# Altium project 100835_project.prjpcb (part 2 of 2)

## Sheet Radio.SchDoc: Radio
size 431 x 279 mm; DrawnBy: D. Bruey, M.Ciuffo; Organization: Synapse Product Development, LLC.; Address1: 1511 6th Ave., Suite 400; Address2: Seattle, Washington 98101; Address3: 206.381.0898; Address4: www.synapse.com; DocumentNumber: 8; SheetNumber: 7; SheetTotal: 10; PageSetup: Record=PageOptions|CenterHorizontal=True|CenterVertical=True|PrintScale=0.95|XCorrection=1.00|YCorrection=1.00|PrintKind=1|BorderSize=5000000|LeftOffset=0|BottomOffset=0|Orientation=2|PaperLength=4318|PaperWidth=2794|Scale=100|PaperSource=7|PrintQuality=200|MediaType=1|DitherType=10|PrintScaleMode=1|PaperKind=11x17|PaperIndex=3
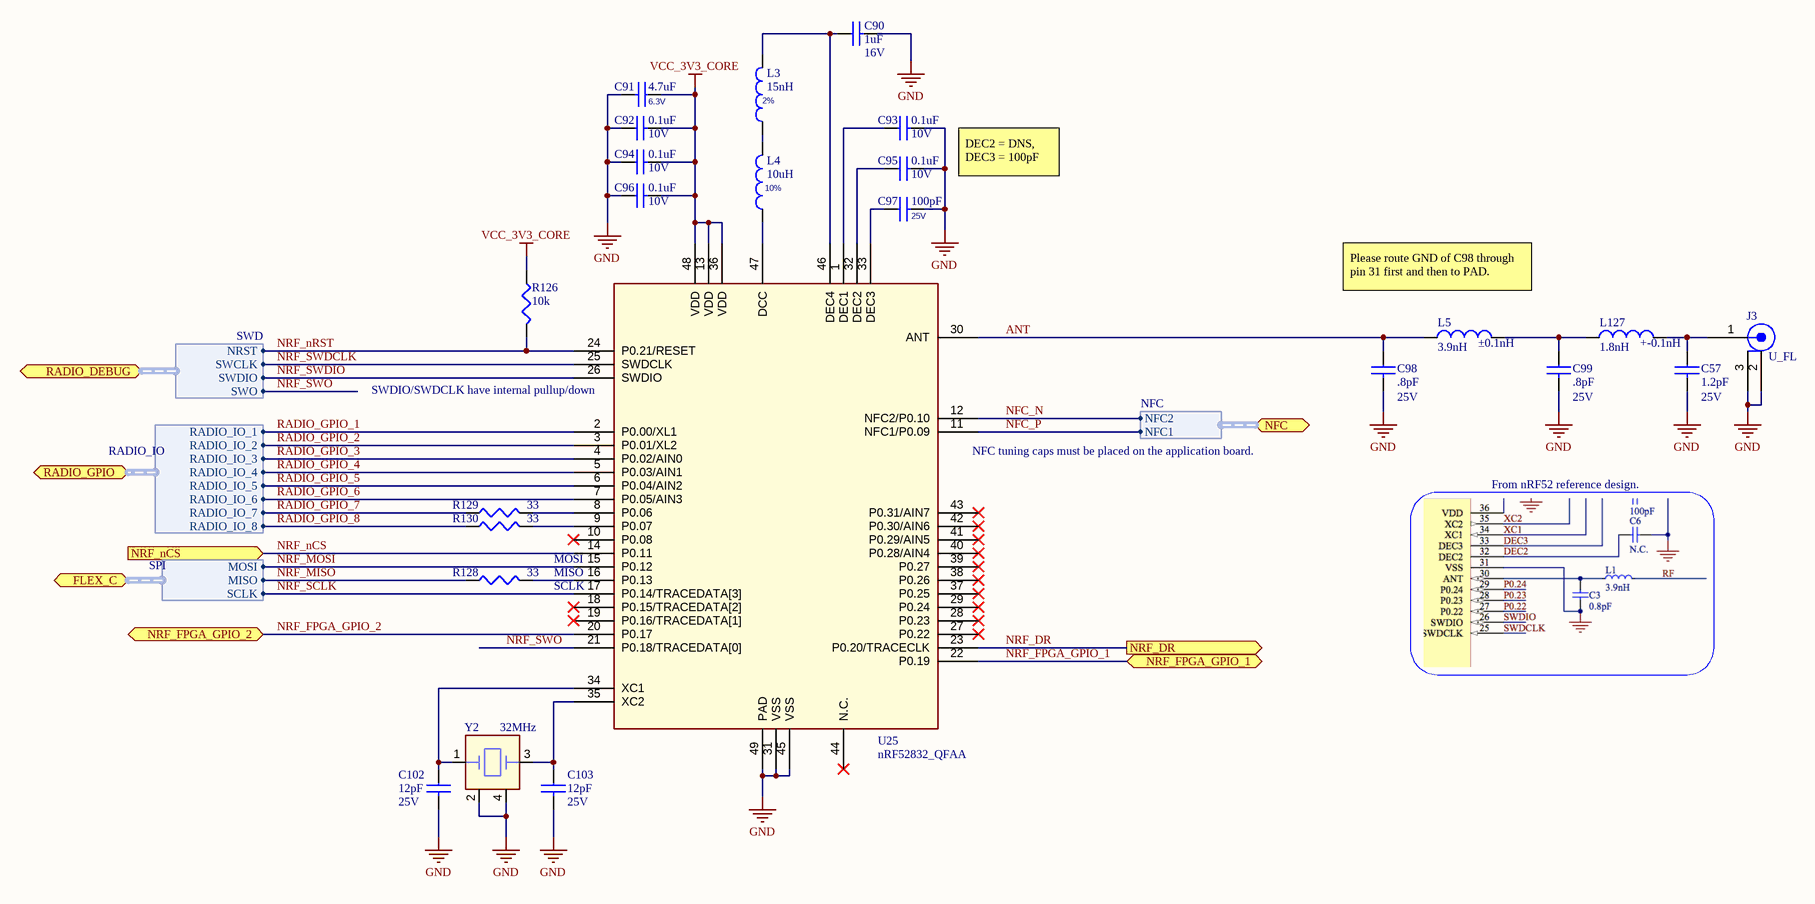
[diagram p7: Radio.SchDoc]

### Parts
C57  1.2pF  Voltage: 25V  [0201-IPCsm_33]
C90  1uF  Voltage: 16V  [0402-IPCsm_55]
C91  4.7uF  Voltage: 6.3V  [0402-IPCsm_55]
C92  0.1uF  Voltage: 10V  [0201-IPCsm_33]
C93  0.1uF  Voltage: 10V  [0201-IPCsm_33]
C94  0.1uF  Voltage: 10V  [0201-IPCsm_33]
C95  0.1uF  Voltage: 10V  [0201-IPCsm_33]
C96  0.1uF  Voltage: 10V  [0201-IPCsm_33]
C97  100pF  Voltage: 25V  [0201-IPCsm_33]
C98  .8pF  Voltage: 25V  [0201-IPCsm_33]
C99  .8pF  Voltage: 25V  [0201-IPCsm_33]
C102  12pF  Voltage: 25V  [0201-IPCsm_33]
C103  12pF  Voltage: 25V  [0201-IPCsm_33]
J3  U_FL  [con_hrs_U_FL-SMT]
L3  15nH  Tolerance: 2%  [IND_0402-36_LQP15M]
L4  10uH  Tolerance: 10%  [IND-0603_32H]
L5  3.9nH  Tolerance: ±0.1nH  [0201-IPCsm_33]
L127  1.8nH  Tolerance: +-0.1nH  [0201-IPCsm_33]
R126  10k  [0201-IPCsm_26]
R128  33  [0201-IPCsm_26]
R129  33  [0201-IPCsm_26]
R130  33  [0201-IPCsm_26]
U25  nRF52832_QFAA  [QFN48_6X6MM_NO_VIAS]
Y2  32MHz  [Xtal_abm12]

### Ports
FLEX_C (harness SPI), NFC (harness NFC), NRF_DR (out), NRF_FPGA_GPIO_1 (bidir), NRF_FPGA_GPIO_2 (bidir), NRF_nCS (in), RADIO_DEBUG (harness SWD), RADIO_GPIO (harness RADIO_IO)

### Harnesses
SWD: NRST, SWCLK, SWDIO, SWO
SPI: MOSI, MISO, SCLK
RADIO_IO: RADIO_IO_1, RADIO_IO_2, RADIO_IO_3, RADIO_IO_4, RADIO_IO_5, RADIO_IO_6, RADIO_IO_7, RADIO_IO_8
NFC: NFC2, NFC1

### Nets
GND: C57.2 C90.2 C91.2 C92.1 C93.2 C94.1 C95.2 C96.1 C97.2 C98.2 C99.2 C102.2 C103.2 J3.2(SHIELD) J3.3(SHIELD2) U25.31(VSS) U25.45(VSS) U25.49(PAD) Y2.2 Y2.4
VCC_3V3_CORE: C91.1 C92.2 C94.2 C96.2 R126.1 U25.13(VDD) U25.36(VDD) U25.48(VDD)
ANT: C98.1 L5.1 U25.30(ANT)
NFC_N: U25.12(NFC2/P0.10) ; port NFC.NFC2
NFC_P: U25.11(NFC1/P0.09) ; port NFC.NFC1
NRF_DR: U25.23(P0.20/TRACECLK) ; port NRF_DR
NRF_FPGA_GPIO_1: U25.22(P0.19) ; port NRF_FPGA_GPIO_1
NRF_FPGA_GPIO_2: U25.20(P0.17) ; port NRF_FPGA_GPIO_2
NRF_MISO: R128.1 ; port FLEX_C.MISO  [project net FLEX_C_MISO]
NRF_MOSI: U25.15(P0.12) ; port FLEX_C.MOSI  [project net FLEX_C_MOSI]
NRF_nCS: U25.14(P0.11) ; port NRF_nCS
NRF_nRST: R126.2 U25.24(P0.21/RESET) ; port RADIO_DEBUG.NRST
NRF_SCLK: U25.17(P0.14/TRACEDATA[3]) ; port FLEX_C.SCLK  [project net FLEX_C_SCLK]
NRF_SWDCLK: U25.25(SWDCLK) ; port RADIO_DEBUG.SWCLK
NRF_SWDIO: U25.26(SWDIO) ; port RADIO_DEBUG.SWDIO
NRF_SWO: U25.21(P0.18/TRACEDATA[0]) ; port RADIO_DEBUG.SWO
RADIO_GPIO_1: U25.2(P0.00/XL1) ; port RADIO_GPIO.RADIO_IO_1
RADIO_GPIO_2: U25.3(P0.01/XL2) ; port RADIO_GPIO.RADIO_IO_2
RADIO_GPIO_3: U25.4(P0.02/AIN0) ; port RADIO_GPIO.RADIO_IO_3
RADIO_GPIO_4: U25.5(P0.03/AIN1) ; port RADIO_GPIO.RADIO_IO_4
RADIO_GPIO_5: U25.6(P0.04/AIN2) ; port RADIO_GPIO.RADIO_IO_5
RADIO_GPIO_6: U25.7(P0.05/AIN3) ; port RADIO_GPIO.RADIO_IO_6
RADIO_GPIO_7: R129.1 ; port RADIO_GPIO.RADIO_IO_7
RADIO_GPIO_8: R130.1 ; port RADIO_GPIO.RADIO_IO_8
NetC57_1: C57.1 J3.1(CENTER) L127.2
NetC90_1: C90.1 L3.2 U25.46(DEC4)
NetC93_1: C93.1 U25.1(DEC1)
NetC95_1: C95.1 U25.32(DEC2)
NetC97_1: C97.1 U25.33(DEC3)
NetC99_1: C99.1 L5.2 L127.1
NetC102_1: C102.1 U25.34(XC1) Y2.1
NetC103_1: C103.1 U25.35(XC2) Y2.3
NetL3_1: L3.1 L4.2
NetL4_1: L4.1 U25.47(DCC)
NetR128_2: R128.2 U25.16(P0.13)
NetR129_2: R129.2 U25.8(P0.06)
NetR130_2: R130.2 U25.9(P0.07)

Not connected (* = marked no-connect by the designer): U25 10(P0.08)* 18(P0.15/TRACEDATA[2])* 19(P0.16/TRACEDATA[1])* 27(P0.22)* 28(P0.23)* 29(P0.24)* 37(P0.25)* 38(P0.26)* 39(P0.27)* 40(P0.28/AIN4)* 41(P0.29/AIN5)* 42(P0.30/AIN6)* 43(P0.31/AIN7)* 44(N.C.)*

### Notes on the sheet
- DEC2 = DNS, DEC3 = 100pF
- Please route GND of C98 through pin 31 first and then to PAD.
- (near U25) SWDIO/SWDCLK have internal pullup/down
- (near U25) NFC tuning caps must be placed on the application board.
- From nRF52 reference design.
- MOSI
- MISO
- SCLK
- Design Notes:
- Layout Notes:
- Project:
- Sheet Title:
- PCBA:
- PROPRIETARY AND CONFIDENTIAL
- Drawn by:
- Schematic Part Number:
- Schematic Revision:
- Date:
- Sheet:
- /

### Library data of the parts
C57 = GJM0335C1E1R2BB01D: Multilayer Ceramic Capacitors MLCC - SMD/SMT 0201 1.2pF 25Volts C0G +/-0.1pF; id: 1351; mfg: Murata; dist: Mouser; dist_pn: 81-GJM0335C1E1R2BB01; source_package: C_1p20P_25V_NPO_0201; type: RF; tolerance: ±0.1pF; TableName: viewAltiumCapacitors; mfg_pn: GJM0335C1E1R2BB01D; part_type: capacitor; height: 0.3MM; status: Good
C90 = CL05A105KO5NNNC: CAP CER 1UF 16V X5R 0402; part_type: capacitor; id: 1304; mfg: Samsung Electro-Mechanics America, Inc.; dist: DIGIKEY; dist_pn: 1276-1067-1-ND; source_package: C_18P_50V_COG_0402; tolerance: 1%; TableName: viewAltiumCapacitors; mfg_pn: CL05A105KO5NNNC; type: X5R; height: 0.56MM; status: Unknown
C91 = GRM155R60J475ME47D: CAP CER 4.7UF 6.3V 20% X5R 0402; part_type: capacitor; id: 855; mfg: MURATA; dist: DIGIKEY; dist_pn: 490-5915-1-ND; symbol: \\SYNAPSEDEV.COM\DFS\FS\EE_STUFF\CAD_LIB\MASTER\MASTER_DISCRETE\CAP; allegro_footprint: 0402-IPCsm_55,c-0402_22H; source_package: C_4P7U_6.3V_X5R_0402; OrCADSymbol: MASTER_DISCRETE\CAP; TableName: viewAltiumCapacitors; mfg_pn: GRM155R60J475ME47D; type: X5R; tolerance: 20%; height: 0.55MM; status: Unknown; SymbolPath: C:\EE-Vault\Libraries\Schematic\MASTER_DISCRETE\CAP
C92-C96 = CL03A104KP3NNNC: CAP CER 0.1UF 10V 10% X5R 0201; part_type: capacitor; id: 1260; mfg: Samsung Electro-Mechanics America, Inc; dist: DIGIKEY; dist_pn: 1276-1115-2-ND; source_package: C_1U_10V_X5R_0201; TableName: viewAltiumCapacitors; mfg_pn: CL03A104KP3NNNC; type: X5R; tolerance: 10%; height: 0.33mm; status: Unknown
C97 = GRM0335C1E101JA01D: CAP CER 100PF 25V 5% NP0 0201; part_type: capacitor; id: 1234; mfg: MURATA; dist: DIGIKEY; dist_pn: 490-3160-6-ND; symbol: \\SYNAPSEDEV.COM\DFS\FS\EE_STUFF\CAD_LIB\MASTER\MASTER_DISCRETE\CAP; allegro_footprint: 0201-IPCsm_33,c-0201_13H; OrCADSymbol: MASTER_DISCRETE\CAP; TableName: viewAltiumCapacitors; mfg_pn: GRM0335C1E101JA01D; type: NP0; tolerance: 5%; height: 0.33MM; status: Good; SymbolPath: C:\EE-Vault\Libraries\Schematic\MASTER_DISCRETE\CAP
C98 = GJM0335C1ER80BB01D: 0.80pF ±0.1pF 25V C0G, NP0 Ceramic Capacitor -55°C ~ 125°C Surface Mount, MLCC 0201 (0603 Metric) 0.024" L x 0.012" W (0.60mm x 0.30mm); id: 1338; mfg: Murata Electronics North America; dist: Digikey; dist_pn: 490-6071-1-ND; source_package: C_1.8pF_25V_C0G_0201; tolerance: 0.05pF; TableName: viewAltiumCapacitors; mfg_pn: GJM0335C1ER80BB01D; part_type: capacitor; type: C0G, NP0; height: 0.33mm; status: Good
C99 = C0603C0G1E0R8W030BF: CAP CER 0.8PF 25V NP0 0201; part_type: capacitor; id: 1082; mfg: TDK Corporation; dist: Digikey; dist_pn: 445-7043-1-ND; source_package: C_1.8pF_25V_C0G_0201; type: C0G, NP0; tolerance: 0.05pF; TableName: viewAltiumCapacitors; mfg_pn: C0603C0G1E0R8W030BF; height: 0.33mm; status: Unknown
C102 C103 = GRM0335C1E120GA01D: 12pF 25V Ceramic Capacitor C0G, NP0 0201; id: 1361; mfg: Murata; dist: Digikey; dist_pn: 490-11967-1-ND; type: C0G, NPO; tolerance: 2%; TableName: viewAltiumCapacitors; mfg_pn: GRM0335C1E120GA01D; part_type: capacitor; height: 0.33MM; status: Unknown
J3 = U.FL-R-SMT(10): CONN RECPT ULTRA-MINI COAX SMD; part_type: connector; id: 944; mfg: HIROSE; dist: DIGIKEY; dist_pn: H9161CT-ND; positions: 1; TableName: viewAltiumConnectors; mfg_pn: U.FL-R-SMT(10); source_package: U_FL; height: 1.25MM; status: Unknown
L3 = LQP15MN15NG02D: IND, 15 nH, 2%, 0402; part_type: inductor; id: 590; mfg: Murata; dist: Digikey; dist_pn: 490-6745-1-ND; symbol: \\synapsedev.com\dfs\FS\EE_STUFF\CAD_LIB\MASTER\MASTER_DISCRETE\IND_H; allegro_footprint: ind_0402-36_lqpq15; source_package: INDUCTOR_4.7nH_0402; OrCADSymbol: MASTER_DISCRETE\IND_H; TableName: viewAltiumInductors; mfg_pn: LQP15MN15NG02D; height: 0.36MM; status: Unknown; SymbolPath: C:\EE-Vault\Libraries\Schematic\MASTER_DISCRETE\IND_H
L4 = CBMF1608T100K: INDUCTOR 10UH 115MA 0603; id: 577; mfg: Taiyo Yuden; dist: DIGIKEY; dist_pn: 587-1720-1-ND; symbol: \\synapsedev.com\dfs\FS\EE_STUFF\CAD_LIB\MASTER\MASTER_DISCRETE\IND_H; source_package: INDUCTOR_10uH_0603; srf: 32MHz; OrCADSymbol: MASTER_DISCRETE\IND_H; TableName: viewAltiumInductors; mfg_pn: CBMF1608T100K; part_type: inductor; allegro_footprint: ind-0603_32H; height: 1MM; current: 115mA; status: Unknown; SymbolPath: C:\EE-Vault\Libraries\Schematic\MASTER_DISCRETE\IND_H
L5 = LQP03TN3N9B02D: FIXED IND 3.9NH 400MA 300 MOHM 0201; part_type: inductor; id: 701; mfg: Murata; dist: DIGIKEY; dist_pn: 490-6730-1-ND; srf: 5.7GHz; TableName: viewAltiumInductors; mfg_pn: LQP03TN3N9B02D; height: 0.33mm; current: 400mA; status: Unknown
L127 = LQP03TN1N8B02D: FIXED IND 1.8NH 600MA 150 MOHM; part_type: inductor; id: 729; mfg: MURATA; dist: DIGIKEY; dist_pn: 490-12981-1-ND; srf: 15000MHz; TableName: viewAltiumInductors; mfg_pn: LQP03TN1N8B02D; height: 0.33MM; current: 600mA; status: Unknown
R126 = RC0201FR-0710KL: RES 10K OHM 1/20W 1% 0201 SMD; part_type: resistor; Tolerance: 1.00%; Voltage: 50V; DIST: DIGIKEY; MFG: YAGEO; DIST_PN: 311-10.0KMCT-ND; Power: 0.05W; id: 1527; source_package: R_10k_0201_1P; TableName: viewAltiumResistors; Height: .26MM; MFG_PN: RC0201FR-0710KL; status: Unknown
R128-R130 = RC0201FR-0733R: RES 33 OHM 1/20W 1% 0201 SMD; part_type: resistor; Tolerance: 1.00%; Voltage: 50V; DIST: DIGIKEY; MFG: YAGEO; DIST_PN: 311-33.0MCT-ND; Power: 0.05W; id: 1544; source_package: R_33_0201_1P; TableName: viewAltiumResistors; Height: .26MM; MFG_PN: RC0201FR-0733R; status: Unknown
U25 = nRF52832-QFAA: IC SOC 2.4GHZ 512K FLASH QFN; Manufacturer: Nordic Semiconductor; Artikkelnr Noca: N.A.; id: 2400; mfg: Nordic; dist: Digikey; dist_pn: 1490-1052-1-ND; TableName: viewAltiumIcs; allegro_footprint: qfn40p600x600x90-49; symbol: \\SYNAPSEDEV.COM\DFS\FS\EE_STUFF\CAD_LIB\MASTER\MASTER_IC\nRF52832_QFAA; where_used: Houston; Part Number: nRF52832-QFAA; Manufacturer Part Number: nRF52832-QFAA; LatestRevisionDate: 2014-11-26; Pin Count: 48; Publisher: Nordic Semiconductor; Published: 2014-11-26; Value: nRF52832-QFAA; Note: *; Supplier: Nordic Semiconductor; Supplier part number: *; 2nd source Supplier: *; 2nd source part number: *; Footprint Doc: QFN-48; Artikkelnr Simpro: N.A.; mfg_pn: nRF52832-QFAA; part_type: ic; source_package: nRF52832; height: 0.9mm; status: Unknown
Y2 = ABM12-32.000MHZ-B2X-T3: Crystal 32.0000MHz 20ppm 8pF 100 Ohm -20°C - 70°C Surface Mount 4-SMD, No Lead (DFN, LCC); id: 1168; mfg: Abracon LLC; dist: Digikey; dist_pn: 535-10256-1-ND; TableName: viewAltiumMisc; mfg_pn: ABM12-32.000MHZ-B2X-T3; part_type: crystal; source_package: ABM12-32.000MHZ-B2X-T3; tolerance: 20ppm; height: .45mm; status: Unknown; datasheet: http://www.abracon.com/Resonators/ABM12.pdf

## Sheet SouthSide.SchDoc: South Side Connector
size 431 x 279 mm; DrawnBy: D. Bruey, M.Ciuffo; Organization: Synapse Product Development, LLC.; Address1: 1511 6th Ave., Suite 400; Address2: Seattle, Washington 98101; Address3: 206.381.0898; Address4: www.synapse.com; DocumentNumber: 12; SheetNumber: 9; SheetTotal: 10; PageSetup: Record=PageOptions|CenterHorizontal=True|CenterVertical=True|PrintScale=0.98|XCorrection=1.00|YCorrection=1.00|PrintKind=1|BorderSize=5000000|LeftOffset=0|BottomOffset=0|Orientation=2|PaperLength=4318|PaperWidth=2794|Scale=100|PaperSource=7|PrintQuality=200|MediaType=1|DitherType=10|PrintScaleMode=1|PaperKind=11x17|PaperIndex=3
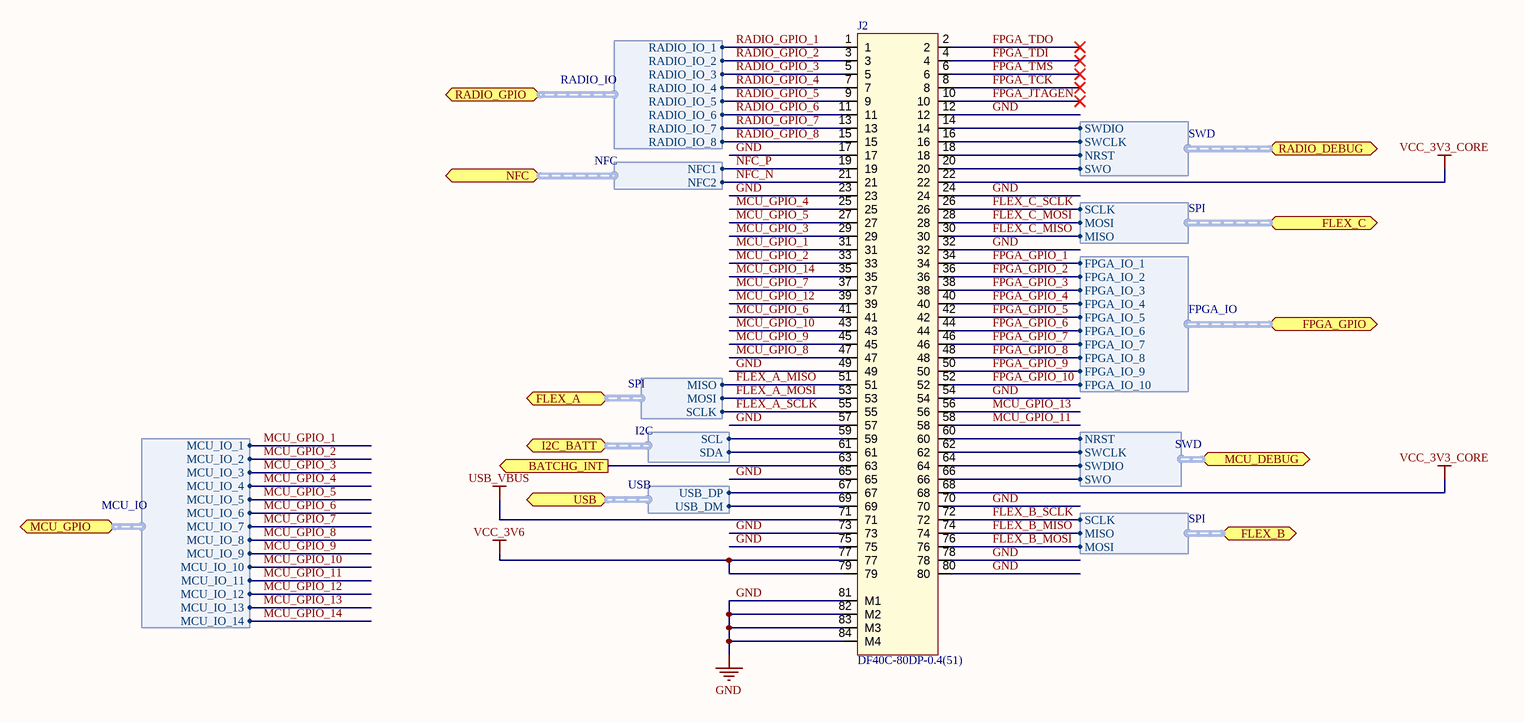
[diagram p8: SouthSide.SchDoc]

### Parts
J2  DF40C-80DP-0.4(51)  [con80_hirose-df40c-80dp_129h]

### Ports
BATCHG_INT (out), FLEX_A (harness SPI), FLEX_B (harness SPI), FLEX_C (harness SPI), FPGA_GPIO (harness FPGA_IO), I2C_BATT (harness I2C), MCU_DEBUG (harness SWD), MCU_GPIO (harness MCU_IO), NFC (harness NFC), RADIO_DEBUG (harness SWD), RADIO_GPIO (harness RADIO_IO), USB (harness USB)

### Harnesses
SPI: MOSI, MISO, SCLK
USB: USB_DM, USB_DP
I2C: SDA, SCL
RADIO_IO: RADIO_IO_1, RADIO_IO_2, RADIO_IO_3, RADIO_IO_4, RADIO_IO_5, RADIO_IO_6, RADIO_IO_7, RADIO_IO_8
NFC: NFC2, NFC1
SWD: NRST, SWCLK, SWDIO, SWO
MCU_IO: MCU_IO_1, MCU_IO_2, MCU_IO_3, MCU_IO_4, MCU_IO_5, MCU_IO_6, MCU_IO_7, MCU_IO_8, MCU_IO_9, MCU_IO_10, MCU_IO_11, MCU_IO_12, MCU_IO_13, MCU_IO_14
FPGA_IO: FPGA_IO_2, FPGA_IO_3, FPGA_IO_4, FPGA_IO_5, FPGA_IO_6, FPGA_IO_7, FPGA_IO_8, FPGA_IO_9, FPGA_IO_10, FPGA_IO_1

### Nets
GND: J2.12 J2.17 J2.23 J2.24 J2.32 J2.49 J2.54 J2.57 J2.65 J2.70 J2.73 J2.75 J2.78 J2.80 J2.81(M1) J2.82(M2) J2.83(M3) J2.84(M4)
USB_VBUS: J2.71
VCC_3V3_CORE: J2.22 J2.68
VCC_3V6: J2.77 J2.79
BATCHG_INT: J2.63 ; port BATCHG_INT
FLEX_A_MISO: J2.51 ; port FLEX_A.MISO
FLEX_A_MOSI: J2.53 ; port FLEX_A.MOSI
FLEX_A_SCLK: J2.55 ; port FLEX_A.SCLK
FLEX_B_MISO: J2.74 ; port FLEX_B.MISO
FLEX_B_MOSI: J2.76 ; port FLEX_B.MOSI
FLEX_B_SCLK: J2.72 ; port FLEX_B.SCLK
FLEX_C_MISO: J2.30 ; port FLEX_C.MISO
FLEX_C_MOSI: J2.28 ; port FLEX_C.MOSI
FLEX_C_SCLK: J2.26 ; port FLEX_C.SCLK
FPGA_GPIO_1: J2.34 ; port FPGA_GPIO.FPGA_IO_1
FPGA_GPIO_2: J2.36 ; port FPGA_GPIO.FPGA_IO_2
FPGA_GPIO_3: J2.38 ; port FPGA_GPIO.FPGA_IO_3
FPGA_GPIO_4: J2.40 ; port FPGA_GPIO.FPGA_IO_4
FPGA_GPIO_5: J2.42 ; port FPGA_GPIO.FPGA_IO_5
FPGA_GPIO_6: J2.44 ; port FPGA_GPIO.FPGA_IO_6
FPGA_GPIO_7: J2.46 ; port FPGA_GPIO.FPGA_IO_7
FPGA_GPIO_8: J2.48 ; port FPGA_GPIO.FPGA_IO_8
FPGA_GPIO_9: J2.50 ; port FPGA_GPIO.FPGA_IO_9
FPGA_GPIO_10: J2.52 ; port FPGA_GPIO.FPGA_IO_10
FPGA_JTAGEN: J2.10
FPGA_MCU_3: J2.66 ; port MCU_DEBUG.SWO
FPGA_TCK: J2.8
FPGA_TDI: J2.4
FPGA_TDO: J2.2
FPGA_TMS: J2.6
MCU_GPIO_1: J2.31 ; port MCU_GPIO.MCU_IO_1
MCU_GPIO_2: J2.33 ; port MCU_GPIO.MCU_IO_2
MCU_GPIO_3: J2.29 ; port MCU_GPIO.MCU_IO_3
MCU_GPIO_4: J2.25 ; port MCU_GPIO.MCU_IO_4
MCU_GPIO_5: J2.27 ; port MCU_GPIO.MCU_IO_5
MCU_GPIO_6: J2.41 ; port MCU_GPIO.MCU_IO_6
MCU_GPIO_7: J2.37 ; port MCU_GPIO.MCU_IO_7
MCU_GPIO_8: J2.47 ; port MCU_GPIO.MCU_IO_8
MCU_GPIO_9: J2.45 ; port MCU_GPIO.MCU_IO_9
MCU_GPIO_10: J2.43 ; port MCU_GPIO.MCU_IO_10
MCU_GPIO_11: J2.58 ; port MCU_GPIO.MCU_IO_11
MCU_GPIO_12: J2.39 ; port MCU_GPIO.MCU_IO_12
MCU_GPIO_13: J2.56 ; port MCU_GPIO.MCU_IO_13
MCU_GPIO_14: J2.35 ; port MCU_GPIO.MCU_IO_14
MCU_nRST: J2.60 ; port MCU_DEBUG.NRST
MCU_SWCLK: J2.62 ; port MCU_DEBUG.SWCLK
MCU_SWDIO: J2.64 ; port MCU_DEBUG.SWDIO
NFC_N: J2.21 ; port NFC.NFC2
NFC_P: J2.19 ; port NFC.NFC1
NRF_nRST: J2.18 ; port RADIO_DEBUG.NRST
NRF_SWDCLK: J2.16 ; port RADIO_DEBUG.SWCLK
NRF_SWDIO: J2.14 ; port RADIO_DEBUG.SWDIO
NRF_SWO: J2.20 ; port RADIO_DEBUG.SWO
RADIO_GPIO_1: J2.1 ; port RADIO_GPIO.RADIO_IO_1
RADIO_GPIO_2: J2.3 ; port RADIO_GPIO.RADIO_IO_2
RADIO_GPIO_3: J2.5 ; port RADIO_GPIO.RADIO_IO_3
RADIO_GPIO_4: J2.7 ; port RADIO_GPIO.RADIO_IO_4
RADIO_GPIO_5: J2.9 ; port RADIO_GPIO.RADIO_IO_5
RADIO_GPIO_6: J2.11 ; port RADIO_GPIO.RADIO_IO_6
RADIO_GPIO_7: J2.13 ; port RADIO_GPIO.RADIO_IO_7
RADIO_GPIO_8: J2.15 ; port RADIO_GPIO.RADIO_IO_8
SCL: J2.59 ; port I2C_BATT.SCL
SDA: J2.61 ; port I2C_BATT.SDA
USB_D_N: J2.69 ; port USB.USB_DM
USB_D_P: J2.67 ; port USB.USB_DP

### Notes on the sheet
- Design Notes:
- Layout Notes:
- Project:
- Sheet Title:
- PCBA:
- PROPRIETARY AND CONFIDENTIAL
- Drawn by:
- Schematic Part Number:
- Schematic Revision:
- Date:
- Sheet:
- /

### Library data of the parts
J2 = DF40C-80DP-0.4(51): CONN HDR 80POS 0.4MM SMD GOLD; part_type: connector; id: 1581; mfg: Hirose; dist: Digikey; dist_pn: H11632CT-ND; symbol: \\synapsedev.com\dfs\FS\EE_STUFF\CAD_LIB\MASTER\MASTER_CON\DF40C-80DP-0.4(51); voltage: 30; positions: 80; TableName: viewAltiumConnectors; mfg_pn: DF40C-80DP-0.4(51); allegro_footprint: con80_hirose-df40c-80dp_129h; height: 1.14mm; status: Unknown; datasheet: http://www.hirose.co.jp/cataloge_hp/ed_DF40_20140305.pdf

## Sheet Revision_Log.SchDoc: Revision Log
size 431 x 279 mm; DrawnBy: D. Bruey, M.Ciuffo; Organization: Synapse Product Development, LLC.; Address1: 1511 6th Ave., Suite 400; Address2: Seattle, Washington 98101; Address3: 206.381.0898; Address4: www.synapse.com; DocumentNumber: 17; SheetNumber: 10; SheetTotal: 10; PageSetup: Record=PageOptions|CenterHorizontal=True|CenterVertical=True|PrintScale=1.06|XCorrection=1.00|YCorrection=1.00|PrintKind=1|BorderSize=5000000|LeftOffset=0|BottomOffset=0|Orientation=2|PaperLength=4318|PaperWidth=2794|Scale=100|PaperSource=7|PrintQuality=200|MediaType=1|DitherType=10|PrintScaleMode=1|PaperKind=11x17|PaperIndex=3
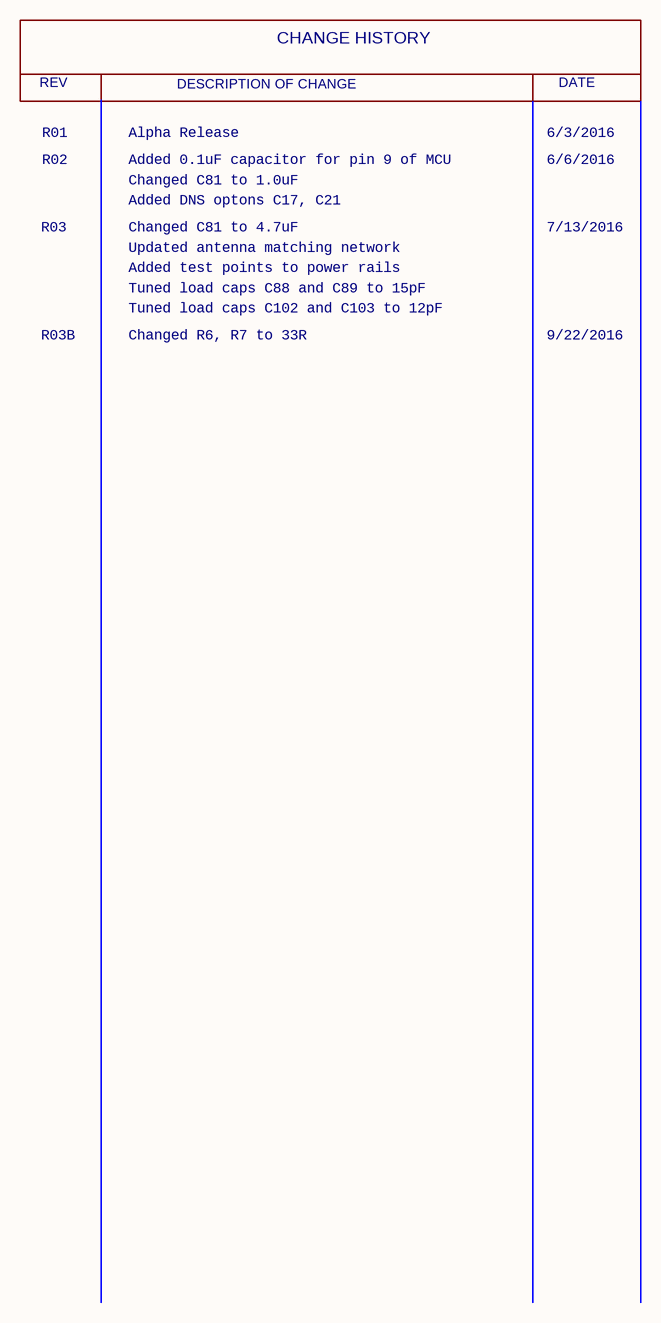
[diagram p9: Revision_Log.SchDoc]

### Notes on the sheet
- REV
- DESCRIPTION OF CHANGE
- CHANGE HISTORY
- DATE
- R01
- R02
- Alpha Release
- Added 0.1uF capacitor for pin 9 of MCU
- 6/3/2016
- 6/6/2016
- R03
- Changed C81 to 1.0uF
- Added DNS optons C17, C21
- Changed C81 to 4.7uF
- 7/13/2016
- Updated antenna matching network
- Added test points to power rails
- Tuned load caps C88 and C89 to 15pF
- R03B
- Tuned load caps C102 and C103 to 12pF
- Changed R6, R7 to 33R
- 9/22/2016
- Design Notes:
- Layout Notes:
- Project:
- Sheet Title:
- PCBA:
- PROPRIETARY AND CONFIDENTIAL
- Drawn by:
- Schematic Part Number:
- Schematic Revision:
- Date:
- Sheet:
- /

## Nets that join several sheets
GND: NorthSide (24 pins), FPGA_Power (30 pins), FPGA_IO (16 pins), PowerCore (19 pins), MCU_IMU (31 pins), Radio (20 pins), SouthSide (18 pins)
USB_VBUS: MCU_IMU (R118.2), SouthSide (J2.71)
VCC_1V2: FPGA_Power (12 pins), PowerCore (6 pins)
VCC_3V3_CORE: FPGA_Power (22 pins), FPGA_IO (C45.1 R13.1 R15.1 Y3.4), PowerCore (C40.1 TP9.1 TP12.1 U6.1), MCU_IMU (24 pins), Radio (8 pins), SouthSide (J2.22 J2.68)
VCC_3V3_SENSORS: FPGA_IO (8 pins), PowerCore (C50.1 TP8.1 TP11.1 U13.1)
VCC_3V6: PowerCore (12 pins), SouthSide (J2.77 J2.79)
BATCHG_INT: MCU_IMU (U24.62), SouthSide (J2.63)
FLEX_A_MISO: MCU_IMU (U24.47), SouthSide (J2.51)
FLEX_A_MOSI: MCU_IMU (R120.1), SouthSide (J2.53)
FLEX_A_SCLK: MCU_IMU (R113.1), SouthSide (J2.55)
FLEX_B_MISO: MCU_IMU (U24.39), SouthSide (J2.74)
FLEX_B_MOSI: MCU_IMU (R114.1), SouthSide (J2.76)
FLEX_B_SCLK: MCU_IMU (R125.2), SouthSide (J2.72)
FLEX_C_MISO: MCU_IMU (R164.1 U24.4), Radio (R128.1), SouthSide (J2.30)
FLEX_C_MOSI: MCU_IMU (R111.2 U23.24), Radio (U25.15), SouthSide (J2.28)
FLEX_C_SCLK: MCU_IMU (R117.1 U23.23), Radio (U25.17), SouthSide (J2.26)
FPGA_CDONE: FPGA_IO (R13.2 TP5.1 U1.M10), MCU_IMU (R14.2 U24.56)
FPGA_CRESET: FPGA_IO (C18.1 R15.2 TP6.1 U1.L10), MCU_IMU (U24.34)
FPGA_DATA_RDY: FPGA_IO (U1.N14), MCU_IMU (U24.60)
FPGA_GPIO_1: FPGA_IO (U1.B14), SouthSide (J2.34)
FPGA_GPIO_2: FPGA_IO (U1.D12), SouthSide (J2.36)
FPGA_GPIO_3: FPGA_IO (U1.C14), SouthSide (J2.38)
FPGA_GPIO_4: FPGA_IO (U1.E12), SouthSide (J2.40)
FPGA_GPIO_5: FPGA_IO (U1.D14), SouthSide (J2.42)
FPGA_GPIO_6: FPGA_IO (U1.F12), SouthSide (J2.44)
FPGA_GPIO_7: FPGA_IO (U1.E14), SouthSide (J2.46)
FPGA_GPIO_8: FPGA_IO (U1.G12), SouthSide (J2.48)
FPGA_GPIO_9: FPGA_IO (U1.F14), SouthSide (J2.50)
FPGA_GPIO_10: FPGA_IO (U1.K14), SouthSide (J2.52)
FPGA_MCU_1: FPGA_IO (U1.L14), MCU_IMU (R14.1)
FPGA_MCU_2: FPGA_IO (U1.P8), MCU_IMU (U24.52)
FPGA_MCU_3: FPGA_IO (U1.P7), MCU_IMU (U24.50), SouthSide (J2.66)
FPGA_MISO: FPGA_IO (R10.1 TP1.1), MCU_IMU (U24.43)
FPGA_MOSI: FPGA_IO (TP2.1 U1.P11), MCU_IMU (R115.2)
FPGA_nCS: FPGA_IO (R12.1 TP4.1 U1.P13), MCU_IMU (U24.44)
FPGA_nRST: FPGA_IO (U1.H1), MCU_IMU (R1.1 U24.3)
FPGA_SCLK: FPGA_IO (TP3.1 U1.P12), MCU_IMU (R116.2)
IMU_INT: FPGA_IO (U1.P14), MCU_IMU (U23.12 U24.58)
MCU_GPIO_1: MCU_IMU (U24.6), SouthSide (J2.31)
MCU_GPIO_2: MCU_IMU (U24.7), SouthSide (J2.33)
MCU_GPIO_3: MCU_IMU (U24.61), SouthSide (J2.29)
MCU_GPIO_4: MCU_IMU (U24.49), SouthSide (J2.25)
MCU_GPIO_5: MCU_IMU (U24.48), SouthSide (J2.27)
MCU_GPIO_6: MCU_IMU (U24.22), SouthSide (J2.41)
MCU_GPIO_7: MCU_IMU (U24.18), SouthSide (J2.37)
MCU_GPIO_8: MCU_IMU (U24.33), SouthSide (J2.47)
MCU_GPIO_9: MCU_IMU (U24.35), SouthSide (J2.45)
MCU_GPIO_10: MCU_IMU (U24.23), SouthSide (J2.43)
MCU_GPIO_11: MCU_IMU (U24.21), SouthSide (J2.58)
MCU_GPIO_12: MCU_IMU (U24.20), SouthSide (J2.39)
MCU_GPIO_13: MCU_IMU (U24.19), SouthSide (J2.56)
MCU_GPIO_14: MCU_IMU (U24.37), SouthSide (J2.35)
MCU_nRST: MCU_IMU (C52.1 R9.2 U24.2), SouthSide (J2.60)
MCU_SWCLK: MCU_IMU (R122.2 U24.55), SouthSide (J2.62)
MCU_SWDIO: MCU_IMU (R112.2 U24.54), SouthSide (J2.64)
NFC_N: Radio (U25.12), SouthSide (J2.21)
NFC_P: Radio (U25.11), SouthSide (J2.19)
NRF_DR: MCU_IMU (U24.59), Radio (U25.23)
NRF_FPGA_GPIO_1: FPGA_IO (U1.A12), Radio (U25.22)
NRF_FPGA_GPIO_2: FPGA_IO (U1.C12), Radio (U25.20)
NRF_nCS: MCU_IMU (U24.14), Radio (U25.14)
NRF_nRST: Radio (R126.2 U25.24), SouthSide (J2.18)
NRF_SWDCLK: Radio (U25.25), SouthSide (J2.16)
NRF_SWDIO: Radio (U25.26), SouthSide (J2.14)
NRF_SWO: Radio (U25.21), SouthSide (J2.20)
POWER_EN: FPGA_IO (Y3.1), PowerCore (5 pins), MCU_IMU (U24.16)
RADIO_GPIO_1: Radio (U25.2), SouthSide (J2.1)
RADIO_GPIO_2: Radio (U25.3), SouthSide (J2.3)
RADIO_GPIO_3: Radio (U25.4), SouthSide (J2.5)
RADIO_GPIO_4: Radio (U25.5), SouthSide (J2.7)
RADIO_GPIO_5: Radio (U25.6), SouthSide (J2.9)
RADIO_GPIO_6: Radio (U25.7), SouthSide (J2.11)
RADIO_GPIO_7: Radio (R129.1), SouthSide (J2.13)
RADIO_GPIO_8: Radio (R130.1), SouthSide (J2.15)
SCL: MCU_IMU (R110.2 U24.8), SouthSide (J2.59)
SDA: MCU_IMU (R109.2 U24.17), SouthSide (J2.61)
SENSOR_A1: NorthSide (J1.1), FPGA_IO (U1.C11)
SENSOR_A2: NorthSide (J1.4), FPGA_IO (U1.D11)
SENSOR_A3: NorthSide (J1.7), FPGA_IO (U1.C10)
SENSOR_A4: NorthSide (J1.10), FPGA_IO (U1.D9)
SENSOR_A5: NorthSide (J1.13), FPGA_IO (U1.A7)
SENSOR_A6: NorthSide (J1.16), FPGA_IO (U1.D7)
SENSOR_A7: NorthSide (J1.19), FPGA_IO (U1.A6)
SENSOR_A8: NorthSide (J1.22), FPGA_IO (U1.D5)
SENSOR_A9: NorthSide (J1.25), FPGA_IO (U1.A5)
SENSOR_A10: NorthSide (J1.28), FPGA_IO (U1.A4)
SENSOR_A11: NorthSide (J1.31), FPGA_IO (U1.A3)
SENSOR_A12: NorthSide (J1.34), FPGA_IO (U1.A2)
SENSOR_A13: NorthSide (J1.37), FPGA_IO (U1.B1)
SENSOR_A14: NorthSide (J1.40), FPGA_IO (U1.E4)
SENSOR_A15: NorthSide (J1.43), FPGA_IO (U1.D3)
SENSOR_A16: NorthSide (J1.46), FPGA_IO (U1.G4)
SENSOR_A17: NorthSide (J1.49), FPGA_IO (U1.F3)
SENSOR_A18: NorthSide (J1.52), FPGA_IO (U1.G1)
SENSOR_A19: NorthSide (J1.55), FPGA_IO (U1.J3)
SENSOR_A20: NorthSide (J1.58), FPGA_IO (U1.L1)
SENSOR_A21: NorthSide (J1.61), FPGA_IO (U1.M1)
SENSOR_A22: NorthSide (J1.64), FPGA_IO (U1.N1)
SENSOR_A23: NorthSide (J1.67), FPGA_IO (U1.P2)
SENSOR_A24: NorthSide (J1.70), FPGA_IO (U1.K4)
SENSOR_A25: NorthSide (J1.73), FPGA_IO (U1.M4)
SENSOR_A26: NorthSide (J1.76), FPGA_IO (U1.L5)
SENSOR_A27: NorthSide (J1.79), FPGA_IO (U1.M6)
SENSOR_A28: NorthSide (J1.82), FPGA_IO (U1.L8)
SENSOR_A29: NorthSide (J1.85), FPGA_IO (U1.M7)
SENSOR_A30: NorthSide (J1.88), FPGA_IO (U1.L12)
SENSOR_A31: NorthSide (J1.91), FPGA_IO (U1.P9)
SENSOR_A32: NorthSide (J1.94), FPGA_IO (U1.J12)
SENSOR_B1: NorthSide (J1.3), FPGA_IO (U1.A11)
SENSOR_B2: NorthSide (J1.6), FPGA_IO (U1.D10)
SENSOR_B3: NorthSide (J1.9), FPGA_IO (U1.A10)
SENSOR_B4: NorthSide (J1.12), FPGA_IO (U1.C9)
SENSOR_B5: NorthSide (J1.15), FPGA_IO (U1.C7)
SENSOR_B6: NorthSide (J1.18), FPGA_IO (U1.D6)
SENSOR_B7: NorthSide (J1.21), FPGA_IO (U1.C6)
SENSOR_B8: NorthSide (J1.24), FPGA_IO (U1.D4)
SENSOR_B9: NorthSide (J1.27), FPGA_IO (U1.C5)
SENSOR_B10: NorthSide (J1.30), FPGA_IO (U1.C4)
SENSOR_B11: NorthSide (J1.33), FPGA_IO (U1.C3)
SENSOR_B12: NorthSide (J1.36), FPGA_IO (U1.A1)
SENSOR_B13: NorthSide (J1.39), FPGA_IO (U1.C1)
SENSOR_B14: NorthSide (J1.42), FPGA_IO (U1.F4)
SENSOR_B15: NorthSide (J1.45), FPGA_IO (U1.D1)
SENSOR_B16: NorthSide (J1.48), FPGA_IO (U1.H4)
SENSOR_B17: NorthSide (J1.51), FPGA_IO (U1.E1)
SENSOR_B18: NorthSide (J1.54), FPGA_IO (U1.G3)
SENSOR_B19: NorthSide (J1.57), FPGA_IO (U1.J1)
SENSOR_B20: NorthSide (J1.60), FPGA_IO (U1.K3)
SENSOR_B21: NorthSide (J1.63), FPGA_IO (U1.M3)
SENSOR_B22: NorthSide (J1.66), FPGA_IO (U1.P1)
SENSOR_B23: NorthSide (J1.69), FPGA_IO (U1.P3)
SENSOR_B24: NorthSide (J1.72), FPGA_IO (U1.L4)
SENSOR_B25: NorthSide (J1.75), FPGA_IO (U1.P4)
SENSOR_B26: NorthSide (J1.78), FPGA_IO (U1.L6)
SENSOR_B27: NorthSide (J1.81), FPGA_IO (U1.P5)
SENSOR_B28: NorthSide (J1.84), FPGA_IO (U1.L9)
SENSOR_B29: NorthSide (J1.87), FPGA_IO (U1.M9)
SENSOR_B30: NorthSide (J1.90), FPGA_IO (U1.K12)
SENSOR_B31: NorthSide (J1.93), FPGA_IO (U1.P10)
SENSOR_B32: NorthSide (J1.96), FPGA_IO (U1.H12)
SENSOR_VCC1: NorthSide (J1.2 J1.8 J1.14 J1.20), FPGA_IO (C47.1 U2.8)
SENSOR_VCC2: NorthSide (J1.26 J1.32 J1.38 J1.44), FPGA_IO (C46.1 U2.5)
SENSOR_VCC3: NorthSide (J1.50 J1.56 J1.62 J1.68), FPGA_IO (C51.1 U3.8)
SENSOR_VCC4: NorthSide (J1.74 J1.80 J1.86 J1.92), FPGA_IO (C48.1 U3.5)
USB_D_N: MCU_IMU (R6.2), SouthSide (J2.69)
USB_D_P: MCU_IMU (R7.2), SouthSide (J2.67)

## Assembly variants
100835: not fitted C17 C21 C95 C99 R54